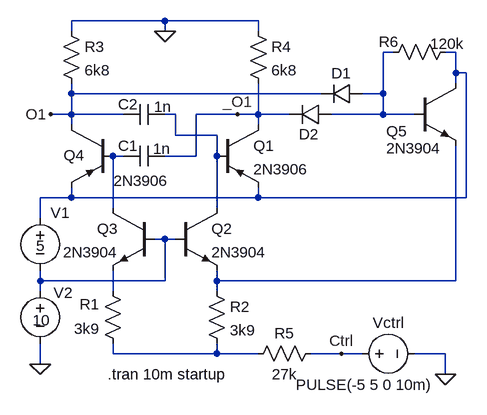
[diagram p0: schematic 5Q_Vco.asc]
5Q_Vco.asc, the LTspice schematic file:
Version 4
SHEET 1 880 680
WIRE 240 -48 96 -48
WIRE 384 -48 240 -48
WIRE 96 -32 96 -48
WIRE 240 -32 240 -48
WIRE 384 -32 384 -48
WIRE 592 0 576 0
WIRE 688 0 672 0
WIRE 688 32 688 0
WIRE 704 32 688 32
WIRE 688 48 688 32
WIRE 96 64 96 48
WIRE 480 64 96 64
WIRE 576 64 576 0
WIRE 576 64 544 64
WIRE 96 96 96 64
WIRE 96 96 64 96
WIRE 176 96 96 96
WIRE 256 96 240 96
WIRE 352 96 288 96
WIRE 384 96 384 48
WIRE 384 96 352 96
WIRE 432 96 384 96
WIRE 576 96 576 64
WIRE 576 96 496 96
WIRE 624 96 576 96
WIRE 96 112 96 96
WIRE 384 112 384 96
WIRE 256 128 256 96
WIRE 320 128 256 128
WIRE 176 160 160 160
WIRE 288 160 288 96
WIRE 288 160 240 160
WIRE 320 160 320 128
WIRE 96 224 96 208
WIRE 96 224 48 224
WIRE 384 224 384 208
WIRE 384 224 96 224
WIRE 704 224 704 32
WIRE 704 224 384 224
WIRE 160 240 160 160
WIRE 320 240 320 160
WIRE 48 256 48 224
WIRE 240 288 224 288
WIRE 256 288 240 288
WIRE 48 352 48 336
WIRE 240 352 240 288
WIRE 240 352 48 352
WIRE 320 352 320 336
WIRE 688 352 688 144
WIRE 688 352 320 352
WIRE 48 368 48 352
WIRE 160 368 160 336
WIRE 320 368 320 352
WIRE 160 464 160 448
WIRE 320 464 320 448
WIRE 320 464 160 464
WIRE 384 464 320 464
WIRE 512 464 464 464
WIRE 544 464 512 464
WIRE 672 464 624 464
WIRE 48 480 48 448
WIRE 672 496 672 464
FLAG 240 -32 0
FLAG 48 480 0
FLAG 672 496 0
FLAG 64 96 O1
FLAG 352 96 _O1
FLAG 512 464 Ctrl
SYMBOL pnp2 320 112 R0
SYMATTR InstName Q1
SYMATTR Value 2N3906
SYMBOL npn2 256 240 R0
SYMATTR InstName Q2
SYMATTR Value 2N3904
SYMBOL npn2 224 240 M0
SYMATTR InstName Q3
SYMATTR Value 2N3904
SYMBOL pnp2 160 112 M0
WINDOW 0 44 47 Left 0
WINDOW 3 -86 86 Left 0
SYMATTR InstName Q4
SYMATTR Value 2N3906
SYMBOL res 144 352 R0
WINDOW 0 -35 36 Left 0
WINDOW 3 -44 74 Left 0
SYMATTR InstName R1
SYMATTR Value 3k9
SYMBOL res 304 352 R0
SYMATTR InstName R2
SYMATTR Value 3k9
SYMBOL res 80 -48 R0
SYMATTR InstName R3
SYMATTR Value 6k8
SYMBOL res 368 -48 R0
SYMATTR InstName R4
SYMATTR Value 6k8
SYMBOL cap 240 144 R90
WINDOW 0 16 57 VBottom 0
WINDOW 3 -11 5 VTop 0
SYMATTR InstName C1
SYMATTR Value 1n
SYMBOL cap 240 80 R90
WINDOW 0 16 57 VBottom 0
WINDOW 3 -11 3 VTop 0
SYMATTR InstName C2
SYMATTR Value 1n
SYMBOL voltage 48 240 R0
WINDOW 0 16 7 Left 0
WINDOW 3 -6 58 Left 0
SYMATTR InstName V1
SYMATTR Value 5
SYMBOL voltage 48 352 R0
WINDOW 0 21 18 Left 0
WINDOW 3 -12 61 Left 0
SYMATTR InstName V2
SYMATTR Value 10
SYMBOL res 480 448 R90
WINDOW 0 0 56 VBottom 0
WINDOW 3 32 56 VTop 0
SYMATTR InstName R5
SYMATTR Value 27k
SYMBOL npn2 624 48 R0
WINDOW 0 -43 74 Left 0
WINDOW 3 -43 100 Left 0
SYMATTR InstName Q5
SYMATTR Value 2N3904
SYMBOL res 688 -16 R90
WINDOW 0 16 103 VBottom 0
WINDOW 3 -12 13 VTop 0
SYMATTR InstName R6
SYMATTR Value 120k
SYMBOL diode 544 48 R90
WINDOW 0 0 32 VBottom 0
WINDOW 3 32 32 Invisible 0
SYMATTR InstName D1
SYMATTR Value 1N914
SYMBOL diode 496 80 R90
WINDOW 0 62 34 VBottom 0
WINDOW 3 32 32 Invisible 0
SYMATTR InstName D2
SYMATTR Value 1N914
SYMBOL voltage 528 464 M90
WINDOW 0 -32 56 VBottom 0
WINDOW 3 32 19 VTop 0
WINDOW 123 0 0 Left 0
WINDOW 39 0 0 Left 0
SYMATTR InstName Vctrl
SYMATTR Value PULSE(-5 5 0 10m)
TEXT 152 496 Left 0 !.tran 10m startup

The netlist it stands for:
* 5Q_Vco.asc
Q1 _O1 N003 N002 0 2N3906
Q2 N003 N005 N006 0 2N3904
Q3 N004 N005 N007 0 2N3904
Q4 O1 N004 N002 0 2N3906
R1 N007 N008 3k9
R2 N006 N008 3k9
R3 0 O1 6k8
R4 0 _O1 6k8
C1 _O1 N004 1n
C2 N003 O1 1n
V1 N002 N005 5
V2 N005 0 10
R5 Ctrl N008 27k
Q5 N002 N001 N006 0 2N3904
R6 N002 N001 120k
D1 N001 O1 1N914
D2 N001 _O1 1N914
Vctrl Ctrl 0 PULSE(-5 5 0 10m)
.model D D
.lib standard.dio
.model NPN NPN
.model PNP PNP
.lib standard.bjt
.tran 10m startup
.backanno
.end